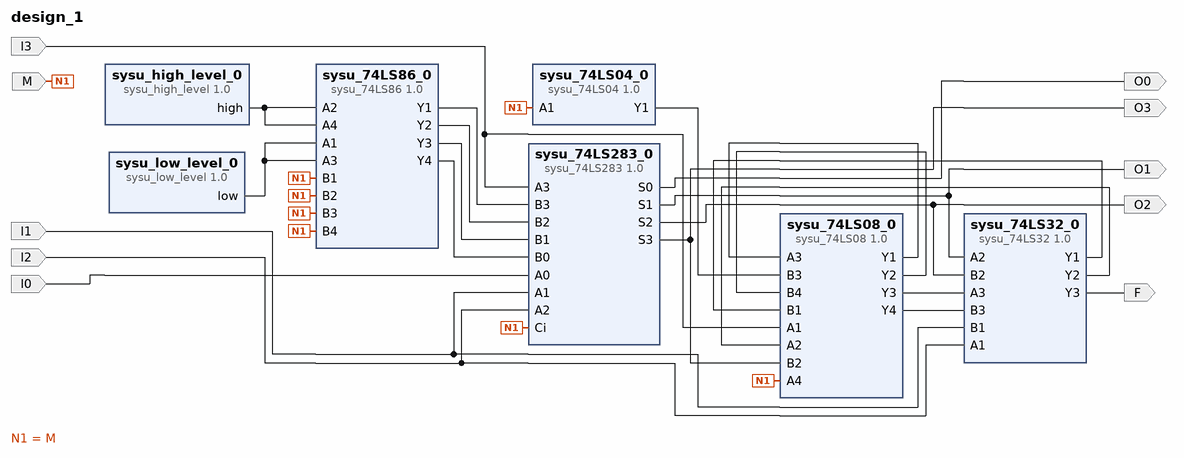
[diagram p0: block diagram of the top level]
# Vivado block design design_1, xc7s50csga324-1, Vivado 2017.4
create_bd_design design_1

create_bd_port -dir O O0
create_bd_port -dir O O1
create_bd_port -dir O O2
create_bd_port -dir O O3
create_bd_port -dir I M
create_bd_port -dir O F
create_bd_port -dir I I0
create_bd_port -dir I I1
create_bd_port -dir I I2
create_bd_port -dir I I3

create_bd_cell -type ip -vlnv xilinx.com:user:sysu_74LS283:1.0 sysu_74LS283_0
create_bd_cell -type ip -vlnv xilinx.com:user:sysu_74LS86:1.0 sysu_74LS86_0
create_bd_cell -type ip -vlnv sysu:user:sysu_74LS32:1.0 sysu_74LS32_0
create_bd_cell -type ip -vlnv sysu:user:sysu_74LS08:1.0 sysu_74LS08_0
create_bd_cell -type ip -vlnv sysu:user:sysu_74LS04:1.0 sysu_74LS04_0
create_bd_cell -type ip -vlnv xilinx.com:user:sysu_high_level:1.0 sysu_high_level_0
create_bd_cell -type ip -vlnv xilinx.com:user:sysu_low_level:1.0 sysu_low_level_0

# ---- connections ----

connect_bd_net [get_bd_pins sysu_74LS86_0/Y1] [get_bd_pins sysu_74LS283_0/B3]
connect_bd_net [get_bd_pins sysu_74LS86_0/Y2] [get_bd_pins sysu_74LS283_0/B2]
connect_bd_net [get_bd_pins sysu_74LS86_0/Y3] [get_bd_pins sysu_74LS283_0/B1]
connect_bd_net [get_bd_pins sysu_74LS86_0/Y4] [get_bd_pins sysu_74LS283_0/B0]
connect_bd_net [get_bd_pins sysu_74LS283_0/S0] [get_bd_ports O0]
connect_bd_net [get_bd_pins sysu_74LS283_0/S1] [get_bd_ports O1] [get_bd_pins sysu_74LS32_0/A2]
connect_bd_net [get_bd_pins sysu_74LS283_0/S2] [get_bd_ports O2] [get_bd_pins sysu_74LS32_0/B2]
connect_bd_net [get_bd_pins sysu_74LS283_0/S3] [get_bd_ports O3] [get_bd_pins sysu_74LS08_0/B2]
connect_bd_net -net A3_0_1 [get_bd_ports I3] [get_bd_pins sysu_74LS283_0/A3] [get_bd_pins sysu_74LS08_0/A1]
connect_bd_net [get_bd_ports M] \
  [get_bd_pins sysu_74LS86_0/B1] [get_bd_pins sysu_74LS86_0/B2] [get_bd_pins sysu_74LS86_0/B3] [get_bd_pins sysu_74LS86_0/B4] \
  [get_bd_pins sysu_74LS283_0/Ci] [get_bd_pins sysu_74LS08_0/A4] [get_bd_pins sysu_74LS04_0/A1]
connect_bd_net [get_bd_pins sysu_74LS32_0/Y1] [get_bd_pins sysu_74LS08_0/B1]
connect_bd_net -net A1_0_1 [get_bd_ports I1] [get_bd_pins sysu_74LS283_0/A1] [get_bd_pins sysu_74LS32_0/B1]
connect_bd_net -net A2_0_1 [get_bd_ports I2] [get_bd_pins sysu_74LS283_0/A2] [get_bd_pins sysu_74LS32_0/A1]
connect_bd_net [get_bd_pins sysu_74LS32_0/Y2] [get_bd_pins sysu_74LS08_0/A2]
connect_bd_net [get_bd_pins sysu_74LS08_0/Y1] [get_bd_pins sysu_74LS08_0/A3]
connect_bd_net [get_bd_pins sysu_74LS08_0/Y2] [get_bd_pins sysu_74LS08_0/B4]
connect_bd_net [get_bd_pins sysu_74LS08_0/Y3] [get_bd_pins sysu_74LS32_0/A3]
connect_bd_net [get_bd_pins sysu_74LS08_0/Y4] [get_bd_pins sysu_74LS32_0/B3]
connect_bd_net [get_bd_pins sysu_74LS32_0/Y3] [get_bd_ports F]
connect_bd_net [get_bd_pins sysu_74LS04_0/Y1] [get_bd_pins sysu_74LS08_0/B3]
connect_bd_net [get_bd_pins sysu_high_level_0/high] [get_bd_pins sysu_74LS86_0/A2] [get_bd_pins sysu_74LS86_0/A4]
connect_bd_net [get_bd_pins sysu_low_level_0/low] [get_bd_pins sysu_74LS86_0/A1] [get_bd_pins sysu_74LS86_0/A3]
connect_bd_net -net I0_1 [get_bd_ports I0] [get_bd_pins sysu_74LS283_0/A0]

validate_bd_design
save_bd_design
